# Altium schematic sheet Sheet2.SchDoc
size A2
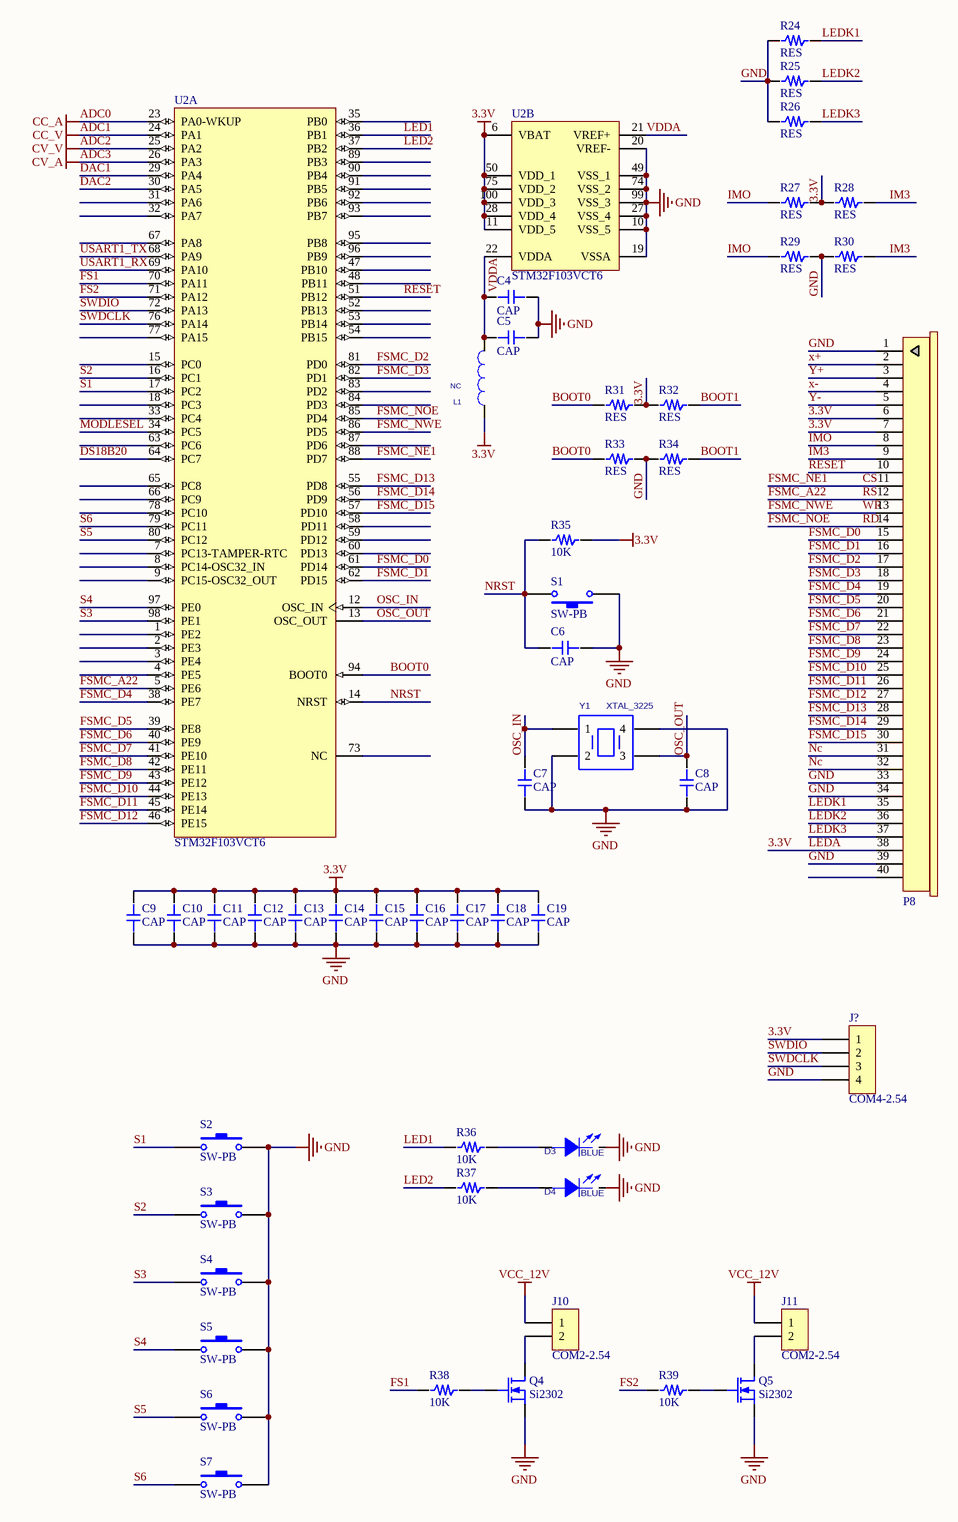
[diagram p0: Sheet2.SchDoc]

## Parts
C4  CAP  [C_0603]
C5  CAP  [C_0603]
C6  CAP  [C_0603-k]
C7  CAP  [C_0603-k]
C8  CAP  [C_0603-k]
C9  CAP  [C_0603]
C10  CAP  [C_0603]
C11  CAP  [C_0603]
C12  CAP  [C_0603]
C13  CAP  [C_0603]
C14  CAP  [C_0603]
C15  CAP  [C_0603]
C16  CAP  [C_0603]
C17  CAP  [C_0603]
C18  CAP  [C_0603]
C19  CAP  [C_0603]
D3  value BLUE  [LED_0603]  (hidden comment: LED)
D4  value BLUE  [LED_0603]  (hidden comment: LED)
J10  COM2-2.54  [COM2-2.54]
J11  COM2-2.54  [COM2-2.54]
J?  COM4-2.54  [COM4-2.54]
L1  value NC  [R_0805]  (hidden comment: IND)
P8  FPC  [FPC0.5-40P-A]  (value not drawn)
Q4  Si2302  [SOT-23]
Q5  Si2302  [SOT-23]
R24  RES  [R_0805]
R25  RES  [R_0805]
R26  RES  [R_0805]
R27  RES  [R_0603]
R28  RES  [R_0603]
R29  RES  [R_0603]
R30  RES  [R_0603]
R31  RES  [R_0603]
R32  RES  [R_0603]
R33  RES  [R_0603]
R34  RES  [R_0603]
R35  10K  [R_0603-k]
R36  10K  [R_0603-k]
R37  10K  [R_0603-k]
R38  10K  [R_0603-k]
R39  10K  [R_0603-k]
S1  SW-PB  [Switch-PB-C-K]
S2  SW-PB  [Switch-PB-C-K]
S3  SW-PB  [Switch-PB-C-K]
S4  SW-PB  [Switch-PB-C-K]
S5  SW-PB  [Switch-PB-C-K]
S6  SW-PB  [Switch-PB-C-K]
S7  SW-PB  [Switch-PB-C-K]
U2  STM32F103VCT6  [STM-LQFP100_N]  (parts A,B of 2)
Y1  XTAL_3225  [XTAL-3225-m]

## Nets
3.3V: C9.2 C10.2 C11.1 C12.1 C13.2 C14.1 C15.1 C16.2 C17.2 C18.2 C19.2 J?.1 L1.1 P8.6 P8.7 P8.38 R27.2 R28.1 R31.2 R32.1 R35.2 U2.6(VBAT) U2.11(VDD_5) U2.28(VDD_4) U2.50(VDD_1) U2.75(VDD_2) U2.100(VDD_3)  [also labelled LEDA]
ADC0: U2.23(PA0-WKUP)  [also labelled CC_A]
ADC1: U2.24(PA1)  [also labelled CC_V]
ADC2: U2.25(PA2)  [also labelled CV_V]
ADC3: U2.26(PA3)  [also labelled CV_A]
GND: C4.2 C5.1 C6.2 C7.1 C8.1 C9.1 C10.1 C11.2 C12.2 C13.1 C14.2 C15.2 C16.1 C17.1 C18.1 C19.1 D3.2(CATHODE) D4.2(CATHODE) J?.4 P8.1 P8.33 P8.34 P8.39 Q4.2(S) Q5.2(S) R24.1 R25.1 R26.1 R29.2 R30.1 R33.2 R34.1 S1.1 S2.2 S3.2 S4.2 S5.2 S6.2 S7.2 U2.10(VSS_5) U2.19(VSSA) U2.20(VREF-) U2.27(VSS_4) U2.49(VSS_1) U2.74(VSS_2) U2.99(VSS_3) Y1.2 Y1.4
VCC_12V: J10.1 J11.1
BOOT0: R31.1 R33.1 U2.94(BOOT0)
BOOT1: R32.2 R34.2
CS: P8.11 U2.88(PD7)  [also labelled FSMC_NE1]
DAC1: U2.29(PA4)
DAC2: U2.30(PA5)
DS18B20: U2.64(PC7)
FS1: R38.1 U2.70(PA11)
FS2: R39.1 U2.71(PA12)
FSMC_A22: P8.12 U2.5(PE6)  [also labelled RS]
FSMC_D0: P8.15 U2.61(PD14)
FSMC_D1: P8.16 U2.62(PD15)
FSMC_D2: P8.17 U2.81(PD0)
FSMC_D3: P8.18 U2.82(PD1)
FSMC_D4: P8.19 U2.38(PE7)
FSMC_D5: P8.20 U2.39(PE8)
FSMC_D6: P8.21 U2.40(PE9)
FSMC_D7: P8.22 U2.41(PE10)
FSMC_D8: P8.23 U2.42(PE11)
FSMC_D9: P8.24 U2.43(PE12)
FSMC_D10: P8.25 U2.44(PE13)
FSMC_D11: P8.26 U2.45(PE14)
FSMC_D12: P8.27 U2.46(PE15)
FSMC_D13: P8.28 U2.55(PD8)
FSMC_D14: P8.29 U2.56(PD9)
FSMC_D15: P8.30 U2.57(PD10)
FSMC_NOE: P8.14 U2.85(PD4)  [also labelled RD]
FSMC_NWE: P8.13 U2.86(PD5)  [also labelled WR]
IM3: P8.9 R28.2 R30.2
IMO: P8.8 R27.1 R29.1
LED1: R36.1 U2.36(PB1)
LED2: R37.1 U2.37(PB2)
LEDK1: P8.35 R24.2
LEDK2: P8.36 R25.2
LEDK3: P8.37 R26.2
MODLESEL: U2.34(PC5)
Nc: P8.31 P8.32
NRST: C6.1 R35.1 S1.2 U2.14(NRST)
OSC_IN: C7.2 U2.12(OSC_IN) Y1.1
OSC_OUT: C8.2 U2.13(OSC_OUT) Y1.3
RESET: P8.10 U2.51(PB12)
S1: S2.1 U2.17(PC2)
S2: S3.1 U2.16(PC1)
S3: S4.1 U2.98(PE1)
S4: S5.1 U2.97(PE0)
S5: S6.1 U2.80(PC12)
S6: S7.1 U2.79(PC11)
SWDCLK: J?.3 U2.76(PA14)
SWDIO: J?.2 U2.72(PA13)
USART1_RX: U2.69(PA10)
USART1_TX: U2.68(PA9)
VDDA: C4.1 C5.2 L1.2 U2.21(VREF+) U2.22(VDDA)
x+: P8.2
x-: P8.4
Y+: P8.3
Y-: P8.5
NetD3_1: D3.1(ANODE) R36.2
NetD4_1: D4.1(ANODE) R37.2
NetJ10_2: J10.2 Q4.3(D)
NetJ11_2: J11.2 Q5.3(D)
NetQ4_1: Q4.1(G) R38.2
NetQ5_1: Q5.1(G) R39.2

Not connected (* = marked no-connect by the designer): P8 40; U2 1(PE2) 2(PE3) 3(PE4) 4(PE5) 7(PC13-TAMPER-RTC) 8(PC14-OSC32_IN) 9(PC15-OSC32_OUT) 15(PC0) 18(PC3) 31(PA6) 32(PA7) 33(PC4) 35(PB0) 47(PB10) 48(PB11) 52(PB13) 53(PB14) 54(PB15) 58(PD11) 59(PD12) 60(PD13) 63(PC6) 65(PC8) 66(PC9) 67(PA8) 73(NC) 77(PA15) 78(PC10) 83(PD2) 84(PD3) 87(PD6) 89(PB3) 90(PB4) 91(PB5) 92(PB6) 93(PB7) 95(PB8) 96(PB9)

## Library data of the parts
L1 = IND: 1uH, 1.1R@245MHz, 245mA; Partname: 贴片电感; Mfr: TDK; Mfr_Part_Number: NLV25T-1R0J-PF; Part_Number: IN100085-01; PCB DECAL: R_0603; Spec: 1uH,NLV25T-1R0J-PF(TDK); Tolerance: 5%; Resistance: 1.1R; Source_Path: D:\CADENCELIB\CAPTURELIB\LC_PASSIVE.OLB; Current: 245mA; Availability: 0
P8 = FPC-40P: FPC排线连接器
Q4 Q5 = Si2302: Nmos
R35-R39 = RES
S1-S7 = SW-PB: Switch; Published: 24-Mar-1999; LatestRevisionDate: 17-Jul-2002; LatestRevisionNote: Re-released for DXP Platform.; PackageReference: SPST-2; Publisher: Altium Limited; PackageDescription: Switch; 2 Leads
U2 = STM32F103VCT6: ARM Cortex-M3 32-bit MCU, 256 KB Flash, 48 KB Internal RAM, 80 I/Os, 100-pin LQFP, -40 to 85 degC, Tray; A/D Converter: 3x12-bit (16 Channel); D/A Converter: 2x12-bit (2 Channel); FLASH Size (Prog) (kB): 256; I/Os (High Current): 80; Internal RAM Size (kB): 48; Operating Frequency(F) (Processor speed) (MHz): 72; Supply Voltage(Vcc) min (V): 2; DatasheetVersion: Rev. 8; PackageVersion: Rev. 1, 06/2013; PackageReference: LQFP100; PackageDescription: 100-Pin Low Profile Quad Flat Package, 14 x 14 mm Body, 0.5 mm Pitch; Supplier 1: Digi-Key; Supplier Part Number 1: 497-9034-ND; Supplier 2: Farnell; Supplier Part Number 2: 1624139; Supplier 3: Newark; Supplier Part Number 3: 57P1255; Supplier 4: Mouser; Supplier Part Number 4: 511-STM32F103VCT6; Core: ARM Cortex-M3; Packing: Tray; Mounting Technology: Surface Mount; PartNumber: STM32F103VCT6; ComponentLink1Description: Manufacturer URL; ComponentLink1URL: http://www.st.com/web/en/home.html; ComponentLink2Description: Datasheet; ComponentLink2URL: http://www.st.com/st-web-ui/static/active/en/resource/technical/document/datasheet/CD00191185.pdf; ComponentLink3Description: Package Specification; ComponentLink3URL: http://www.st.com/st-web-ui/static/active/en/resource/technical/document/data_brief/DM00071938.pdf
Y1 = XTAL_3225: 贴片晶振
D3 D4 = LED: PCB DECAL: LED_0603